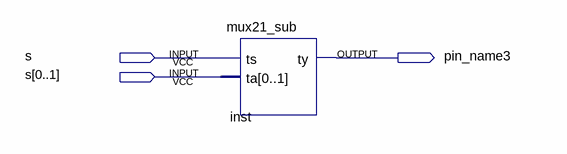
[diagram p0: schematic sheet]
// Quartus schematic week5_fix2test.bdf as structural Verilog: 1 symbols, 3 pins
module week5_fix2test (
  input  s_1bit,
  input  [0:1] s,
  output pin_name3
);

  mux21_sub inst (.ts(s_1bit), .ta(s), .ty(pin_name3));
endmodule
